# Altium schematic sheet ignitor test.SchDoc
size A; SheetNumber: 1; SheetTotal: 1
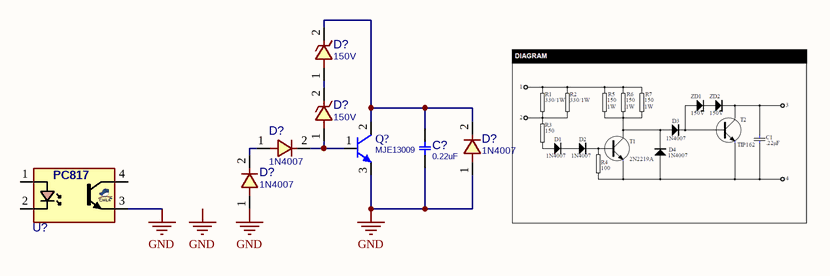
[diagram p0: ignitor test.SchDoc]

## Parts
(Parts that share a designator on the sheet are numbered #1, #2 ... from top to bottom, then left to right.)
C?  0.22uF  [C_FLM_17X7H14]
D?#1  150V  [D_AX03_DO35]
D?#2  150V  [D_AX03_DO35]
D?#3  1N4007  [D_AX04_DO41]
D?#4  1N4007  [D_AX04_DO41]
D?#5  1N4007  [D_AX04_DO41]
Q?  MJE13009  [TO220_3]
U?  PC817  [DIP_4]  (value not drawn)

## Nets
GND: C?.1 D?#4.1 D?#5.1 Q?.3(E) U?.3(E)
NetC?_2: C?.2 D?#1.2 D?#4.2 Q?.2(C)
NetD?#1_1: D?#1.1 D?#2.2
NetD?#2_1: D?#2.1 D?#3.2 Q?.1(B)
NetD?#3_1: D?#3.1 D?#5.2

Not connected (* = marked no-connect by the designer): U? 1(A) 2(K) 4(C)

## Notes on the sheet
- Labels drawn without touching a wire or pin: GND

## Library data of the parts
C? = CAP_THD_FLM: CAP, THD, FILM,; MANF_P#: MANF_PART#; PARAM2: 25V; DESC: DESCRIPTION; DIST#: MOUSER; PARAM: 20%; PRICE: 10= 5$; MANF: MANF; ASSEMBLY: ASSEMBLY; VALUE: 0.22uF
D?#1 D?#2 = DIODE_THD_ZENER: DIODE, ZENER, 0.2W, 15V; MANF: Diodes; DESC: DESCRIPTION; ASSEMBLY: ASSEMBLY; PRICE: PRICE; PARAM2: 0.2W; PARAM: 150V; MANF_P#: 150V; VALUE: 150V
D?#3-D?#5 = DIODE_THD_1N4007: DIODE, GENERAL PURPOSE, 1000V/1A; MANF: Diodes; DESC: DESCRIPTION; PARAM: 1000V, 1.15V; PARAM2: 1.5A; ASSEMBLY: ASSEMBLY; PRICE: PRICE; MANF_P#: 1N4007; VALUE: 1N4007
Q? = NPN_MJE13005A_TO220: BJT, NPN, 400v, 4A, THD, TO-220; PARAM: 400v, 12A; PARAM2: 100W; MANF_P#: MJE13009; MANF: -; VALUE: MJE13009
U? = OPTC_TR4P_PC817: OPTOCOUPLER, TRANSISTOR, 4PIN; PARAM: IF=20mA; PARAM2: VCE = 35V; MANF: SHARP; MANF_P#: PC817; PRICE: -; VALUE: PC817; PACKAGE: DIP-4